# Altium schematic sheet MCU.SchDoc: Ateml SAM4S8 MCU
size A3; DrawnBy: Hassan Alhujhoj, Abdullah Naeem; Address1: ECE Department; Address2: University of Canterbury; Address3: Christchurch 8041; Address4: New Zealand; Revision: 1; SheetNumber: 1; SheetTotal: 2
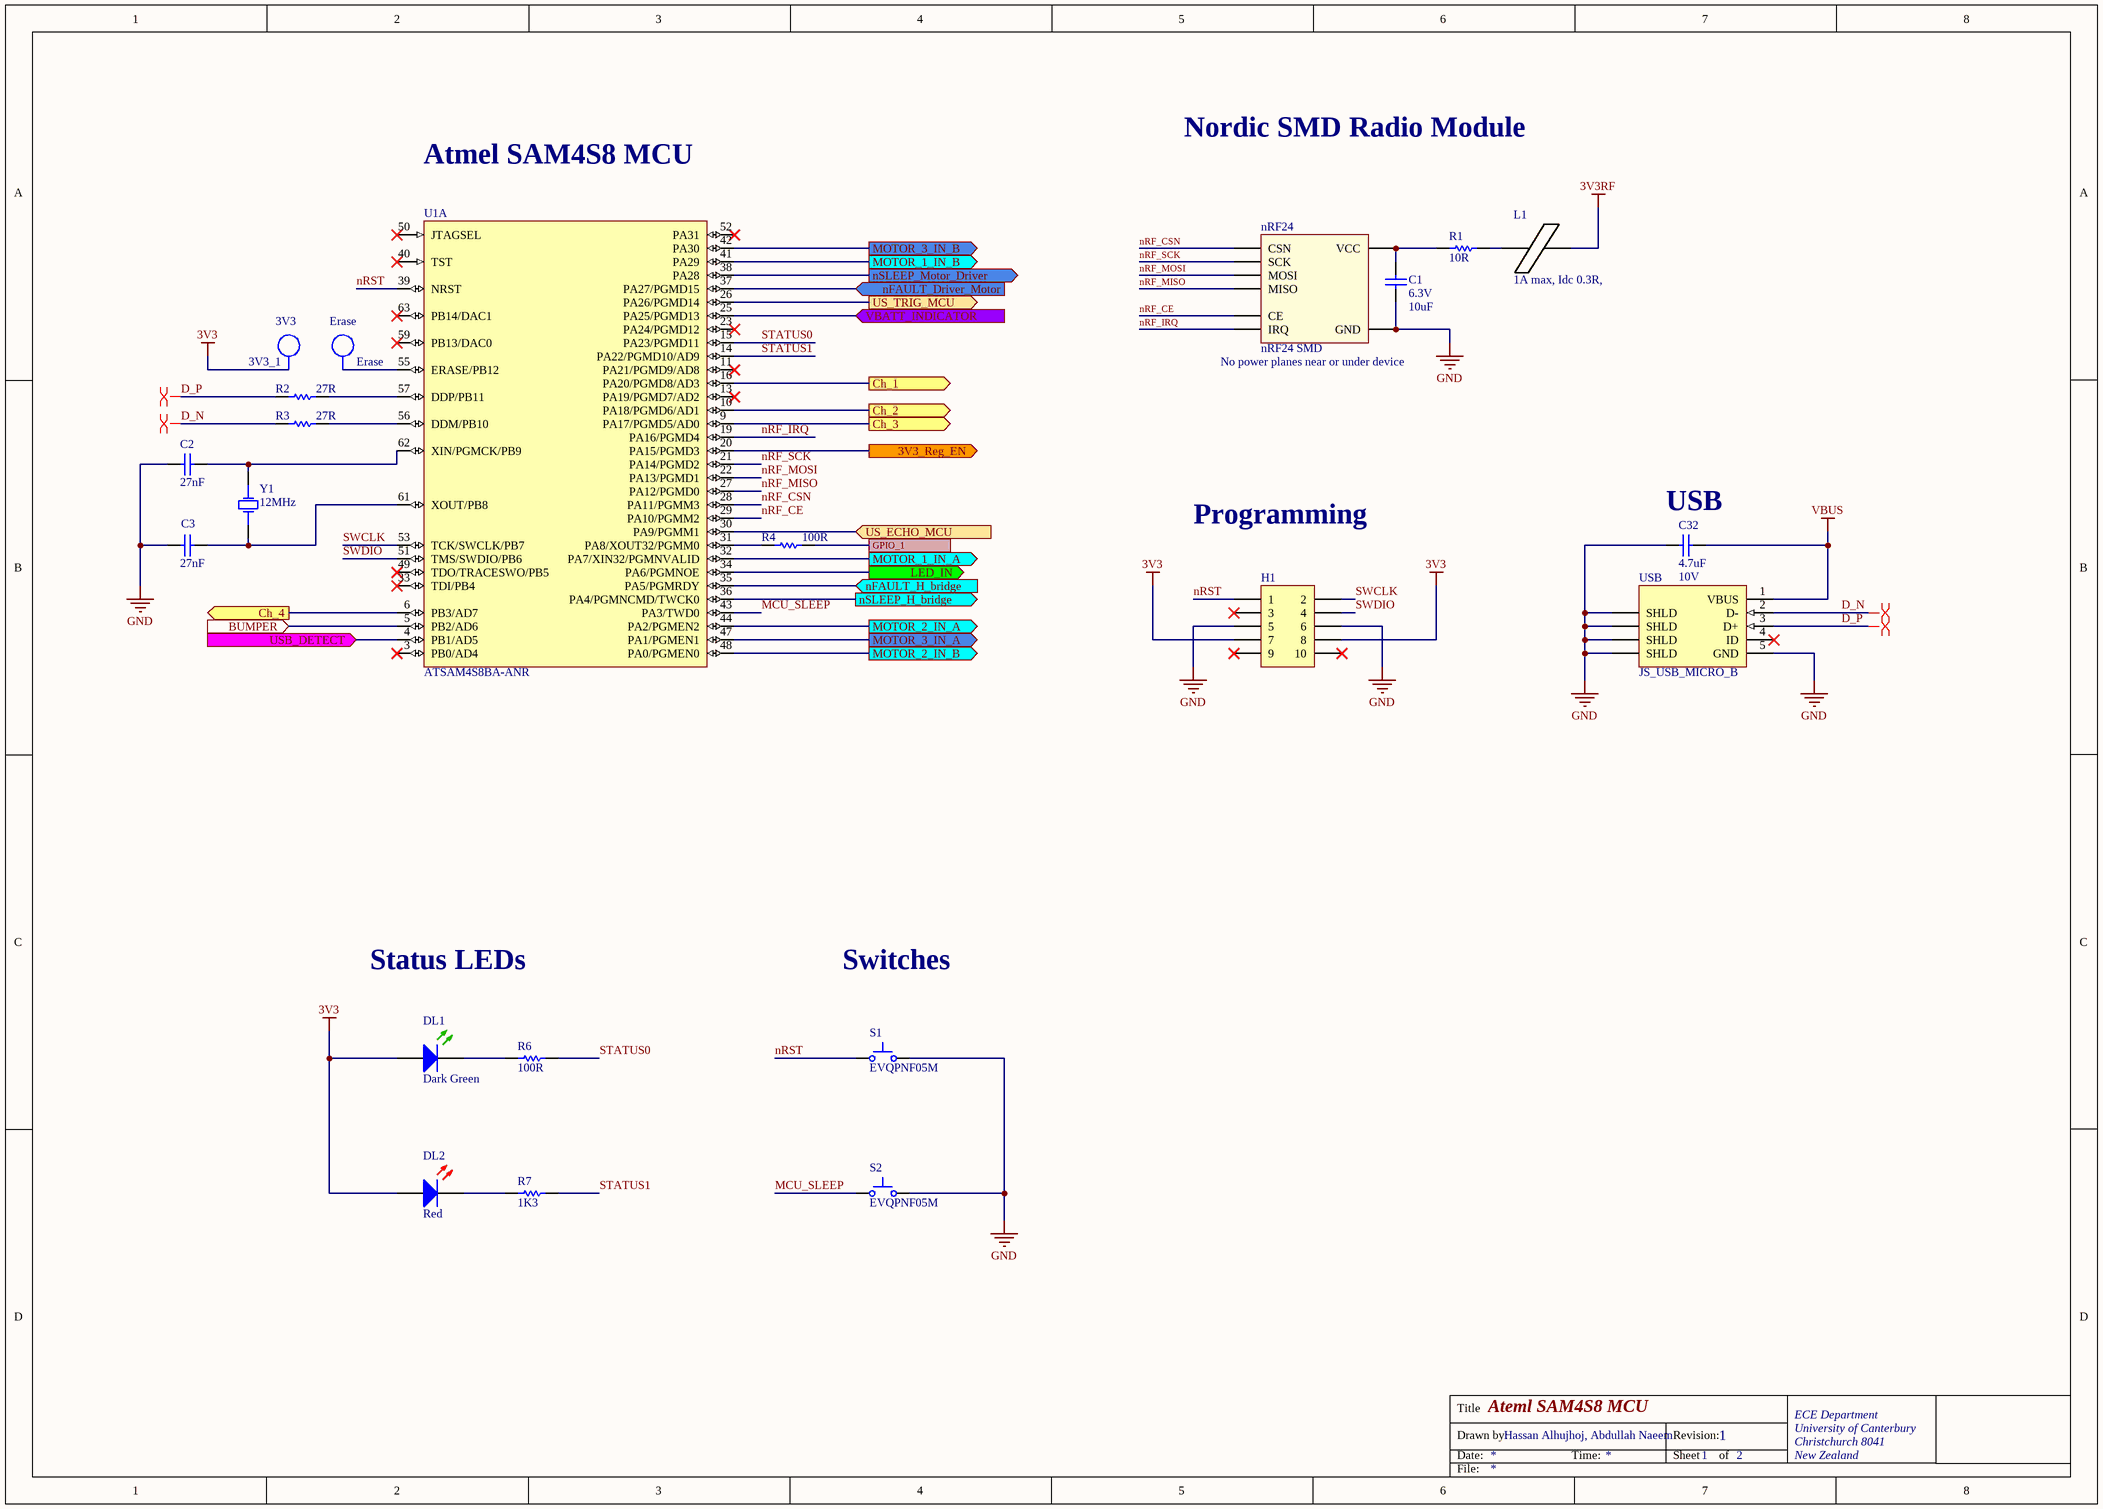
[diagram p0: MCU.SchDoc]

## Parts
3V3_1  TP  [TP_1206]  (value not drawn)  (no BOM)
C1  Voltage - Rated: 6.3V  [CAPC1608L]  (hidden comment: 10uF)
C2  27nF  [CAPC1608L]
C3  27nF  [CAPC1608L]
C32  Max Voltage: 10V  [CAPC1608N]  (hidden comment: 4.7uF)
DL1  Dark Green  [WL-SMCW0603]
DL2  Red  [WL-SMCW0603]
Erase  TP  [TP_1206]  (value not drawn)  (no BOM)
H1  Header 5X2 Vert  [IDC2.54-V10D]  (value not drawn)
L1  1A max, Idc 0.3R,  [INDC3216L]
nRF24  nRF24 SMD  Warning: No power planes near or under device  [NRF24]
R1  10R  [RESC1608L]
R2  27R  [RESC1608L]
R3  27R  [RESC1608L]
R4  100R  [RESC1608L]
R6  100R  [RESC1608L]
R7  1K3  [RESC1608L]
S1  EVQPNF05M  [EVQPNF05M]
S2  EVQPNF05M  [EVQPNF05M]
U1  ATSAM4S8BA-ANR  [LQFP64_L]  (part A of 2)
USB  JS_USB_MICRO_B  [FCI_USB_10118194-0001LF]
Y1  12MHz  [6.0X3.5-4]

## Ports
3V3_Reg_EN (out), BUMPER (in), Ch_1 (out), Ch_2 (out), Ch_3 (out), Ch_4 (out), GPIO_1, LED_IN (out), MOTOR_1_IN_A (out), MOTOR_1_IN_B (out), MOTOR_2_IN_A (out), MOTOR_2_IN_B (out), MOTOR_3_IN_A (out), MOTOR_3_IN_B (out), nFAULT_Driver_Motor (in), nFAULT_H_bridge (in), nSLEEP_H_bridge (out), nSLEEP_Motor_Driver (out), US_ECHO_MCU (in), US_TRIG_MCU (out), USB_DETECT (in), VBATT_INDICATOR (in)

## Nets
3V3: 3V3_1.1 DL1.2(A) DL2.2(A) H1.7 H1.8
3V3RF: L1.2
GND: C1.1 C2.1 C3.1 C32.1 H1.5 H1.6 nRF24.2(GND) S1.2 S2.2 USB.5(GND) USB.6(SHLD)
VBUS: C32.2 USB.1(VBUS)
3V3_Reg_EN: U1.20(PA15/PGMD3) ; port 3V3_Reg_EN
BUMPER: U1.5(PB2/AD6) ; port BUMPER
Ch_1: U1.16(PA20/PGMD8/AD3) ; port Ch_1
Ch_2: U1.10(PA18/PGMD6/AD1) ; port Ch_2
Ch_3: U1.9(PA17/PGMD5/AD0) ; port Ch_3
Ch_4: U1.6(PB3/AD7) ; port Ch_4
D_N: R3.1 USB.2(D-)
D_P: R2.1 USB.3(D+)
GPIO_1: R4.2 ; port GPIO_1
LED_IN: U1.34(PA6/PGMNOE) ; port LED_IN
MCU_SLEEP: S2.1 U1.43(PA3/TWD0)
MOTOR_1_IN_A: U1.32(PA7/XIN32/PGMNVALID) ; port MOTOR_1_IN_A
MOTOR_1_IN_B: U1.41(PA29) ; port MOTOR_1_IN_B
MOTOR_2_IN_A: U1.44(PA2/PGMEN2) ; port MOTOR_2_IN_A
MOTOR_2_IN_B: U1.48(PA0/PGMEN0) ; port MOTOR_2_IN_B
MOTOR_3_IN_A: U1.47(PA1/PGMEN1) ; port MOTOR_3_IN_A
MOTOR_3_IN_B: U1.42(PA30) ; port MOTOR_3_IN_B
nFAULT_Driver_Motor: U1.37(PA27/PGMD15) ; port nFAULT_Driver_Motor
nFAULT_H_bridge: U1.35(PA5/PGMRDY) ; port nFAULT_H_bridge
nRF_CE: nRF24.3(CE) U1.29(PA10/PGMM2)
nRF_CSN: nRF24.4(CSN) U1.28(PA11/PGMM3)
nRF_IRQ: nRF24.8(IRQ) U1.19(PA16/PGMD4)
nRF_MISO: nRF24.7(MISO) U1.27(PA12/PGMD0)
nRF_MOSI: nRF24.6(MOSI) U1.22(PA13/PGMD1)
nRF_SCK: nRF24.5(SCK) U1.21(PA14/PGMD2)
nRST: H1.1 S1.1 U1.39(NRST)
nSLEEP_H_bridge: U1.36(PA4/PGMNCMD/TWCK0) ; port nSLEEP_H_bridge
nSLEEP_Motor_Driver: U1.38(PA28) ; port nSLEEP_Motor_Driver
STATUS0: R6.2 U1.15(PA23/PGMD11)
STATUS1: R7.2 U1.14(PA22/PGMD10/AD9)
SWCLK: H1.2 U1.53(TCK/SWCLK/PB7)
SWDIO: H1.4 U1.51(TMS/SWDIO/PB6)
US_ECHO_MCU: U1.30(PA9/PGMM1) ; port US_ECHO_MCU
US_TRIG_MCU: U1.26(PA26/PGMD14) ; port US_TRIG_MCU
USB_DETECT: U1.4(PB1/AD5) ; port USB_DETECT
VBATT_INDICATOR: U1.25(PA25/PGMD13) ; port VBATT_INDICATOR
NetC1_2: C1.2 nRF24.1(VCC) R1.1
NetC2_2: C2.2 U1.62(XIN/PGMCK/PB9) Y1.3(OSC2)
NetC3_2: C3.2 U1.61(XOUT/PB8) Y1.1(OSC1)
NetDL1_1: DL1.1(K) R6.1
NetDL2_1: DL2.1(K) R7.1
NetErase_1: Erase.1 U1.55(ERASE/PB12)
NetL1_1: L1.1 R1.2
NetR2_2: R2.2 U1.57(DDP/PB11)
NetR3_2: R3.2 U1.56(DDM/PB10)
NetR4_1: R4.1 U1.31(PA8/XOUT32/PGMM0)

Not connected (* = marked no-connect by the designer): H1 3* 9* 10*; U1 3(PB0/AD4)* 11(PA21/PGMD9/AD8)* 13(PA19/PGMD7/AD2)* 23(PA24/PGMD12)* 33(TDI/PB4)* 40(TST)* 49(TDO/TRACESWO/PB5)* 50(JTAGSEL)* 52(PA31)* 59(PB13/DAC0)* 63(PB14/DAC1)*; USB 4(ID)*

## Layout directives
differential pair: D_N, D_P

## Notes on the sheet
- Atmel SAM4S8 MCU
- Nordic SMD Radio Module
- (near 3V3_1) 3V3
- (near Erase) Erase
- (near C32) USB
- Programming
- Status LEDs
- Switches
- Title
- Drawn by:
- Date:
- Time:
- Revision:
- Sheet
- of
- File:

## Library data of the parts
3V3_1 Erase = TP_1206: Test-Point 3.3x1.6x2.1mm SMD; Manufacturer: Harwin Inc; Manufacturer Part Number: S1751-46R; Manufacturer PN: *; Storage Location: ProtoPlace; Mounting Type: Surface Mount; Type: PC Test Point; Supplier 1: Digi-Key; Supplier Part Number 1: 952-1478-2-ND; Supplier 2: Farnell; Supplier Part Number 2: 1826282; Supplier: ECE Dept; Value: TP
C1 = CC_10uF_0603: CAP CER 10UF X5R +-20% 6V3 0603; Supplier: ECE Dept; Storage Location: PCB Assembly WS; Value: 10uF
C2 C3 = CC_27nF_0603: CAP CER 27nF X7R +-10% 50V 0603; PackageReference: 0603; Code_IPC: 1608 [0603]; Verify: *; Supplier: ECE Dept; Storage Location: PCB Assembly WS; Value: 27nF
C32 = CC_4.7uF_0603: CAP CER 4.7uF X5R +-20%  10V 0603; Note: Footprint corresponds to dimensions for bulk cassette packaging. This case size has tightened tolerances.; PackageReference: 0805; Code_IPC: 2012[0805]; Verify: *; Supplier: ECE Dept; Storage Location: PCB Assembly WS; Value: 4.7uF
DL1 = DL_150060GS75000: LED Dk Green 430mcd 0603 SMD; Manufacturer: WURTH ELEKTRONIK; Forward Current If: 30; Wavelength Typ: 520; Forward Voltage: 3.2; Lens Shape: Rectangular; Luminous Intensity: 430; Viewing Angle: 140°; LED Mounting: SMD; Supplier 1: Farnell; Supplier Part Number 1: 2322070; Manufacturer Part Number: 150060GS75000; Storage Location: PCB Assembly WS; Supplier: ECE Dept; LED Colour: Dark Green
DL2 = DL_150060RS75000: LED Red 250mcd 0603 SMD; Manufacturer: WURTH ELEKTRONIK; Forward Current If: 30; Forward Voltage: 2; Lens Shape: Rectangular; Luminous Intensity: 250; Wavelength Typ: 625; Viewing Angle: 140°; LED Mounting: SMD; Supplier 1: Farnell; Supplier Part Number 1: 2322071; Manufacturer Part Number: 150060RS75000; Storage Location: PCB Assembly WS; Supplier: ECE Dept; LED Colour: Red
H1 = JA_HDR_IDC_5X2_VERT: IDC Header, 2,54mm, 10-Pin, Vert; Supplier: ECE Dept; Supplier 1: Farnell; Supplier Part Number 1: 1096985; Storage Location: ECE Dept Store
L1 = IN_Ferrite-Bead: Ferrite Bead, Rdc 0.3R, Z100MHZ 600R, Imax 1A, SMD 1206; Manufacturer: FAIR-RITE; Manufacturer PN: 2512066017Y1; DC Current Rating: 1; DC Resistance Max: 0.08; Ferrite Case Style: 1206 ^3216 Metric]; Frequency Range: 50MHz to 1; Impedance: 600; Impedance Tolerance: ± 25%; Supplier: ECE Dept; Storage Location: PCB Assembly WS; Ferrite Mounting: SMD; Supplier 1: Farnell; Supplier Part Number 1: 1612060; Manufacturer Part Number: 2512066017Y1; Value: 1A max, Idc 0.3R,
nRF24 = NRF24: nRF24 SMD Module
R1 = RS_10R: RES 10 OHM 1/10W 5% 0603 SMD; Storage Location: PCB Assembly WS; Supplier: ECE Dept; Value: 10R
R2 R3 = RS_27R: RES 27 OHM 1/10W 5% 0603 SMD; Storage Location: PCB Assembly WS; Supplier: ECE Dept; Value: 27R
R4 R6 = RS_100R: RES 100 OHM 1/10W 5% 0603 SMD; Storage Location: PCB Assembly WS; Supplier: ECE Dept; Value: 100R
R7 = RS_1K3: RES 1.3K OHM 1/10W 5% 0603 SMD; Storage Location: PCB Assembly WS; Supplier: ECE Dept; Value: 1K3
S1 S2 = WS_EVQPNF05M: Panasonic 6 x 3.5mm SMD Light Touch Switch Type SMD; PackageDescription: 6.0 x 3.5 mm; Supplier 1: Farnell; Supplier Part Number 1: 2079481; Manufacturer: Panasonic; Manufacturer PN: EVQPNF05M; Supplier 2: Digi-Key; Supplier Part Number 2: P13598SCT-ND; Storage Location: PCB Assembly WS; Supplier: ECE Dept
U1 = SE_ATSAM4S16BA-MU: IC MCU 32BIT 512KB FLASH 64LQFP; Manufacturer: Atmel; Connectivity: I²C, IrDA, Memory Card, SPI, SSC, UART/USART, USB; Core Processor: ARM® Cortex®-M4; Core Size: 32-Bit; Data Converters: A/D 11x12b, D/A 2x12b; Number of I/O: 47; Peripherals: Brown-out Detect/Reset, DMA, POR, PWM, WDT; Program Memory Size: 512KB (512K x 8); RAM Size: 128K x 8; Speed: 120MHz; Voltage - Supply (Vcc/Vdd): 1.62 V ~ 3.6 V; PackageVersion: revJ, Jul-2007; PackageReference: 64PS; PackageDescription: 64-Pin Quad Flat No-Lead (QFN) Sawn, 9 x 9 x 1.0 mm Body, 0.5 mm Pitch, Exposed Pad; Code_JEDEC: MO-220VMMD-3; ComponentLink1Description: Manufacturer URL; ComponentLink1URL: http://www.atmel.com/; ComponentLink2Description: SAM4S Series Datasheet; ComponentLink2URL: http://www.atmel.com/dyn/resources/prod_documents/11100.pdf; ComponentLink3Description: SAM4S Series Summary; ComponentLink3URL: http://www.atmel.com/dyn/resources/prod_documents/11100S.pdf; Supplier 1: Digi-Key; Package / Case: 64-LQFP; Packaging: Cut Tape (CT); Program Memory Type: FLASH; Supplier Part Number 1: ATSAM4S8BA-ANRCT-ND; Manufacturer Part Number: ATSAM4S8BA-ANR
USB = JS_USB_MICRO_B_SMT: CONN USB MICRO B RECPT SMT R/A; Manufacturer: FCI; Manufacturer Part Number: 10118194-0001LF; Gender: Receptacle; Number of Contacts: 5; Specifications: USB 2.0; Supplier 1: Digi-Key; Supplier Part Number 1: 609-4618-1-ND; Features: Shielded, Solder Retention; Mounting Type: Surface Mount, Right Angle, Horizontal
Y1 = XT_CRYSTAL_12MHz_18pF: CRYSTAL 12MHZ 18PF 6X3.5mm SMD; Manufacturer: CTS-Frequency Controls; Manufacturer Part Number: 406C35D12M00000; ESR (Equivalent Series Resistance): 60 Ohm; Frequency Stability: ±50ppm; Frequency Tolerance: ±30ppm; Operating Mode: Fundamental; Supplier 1: Digi-Key; Height: 0.047" (1.20mm); Load Capacitance: 18pF; Mounting Type: Surface Mount; Operating Temperature: -20°C ~ 70°C; Package / Case: 4-SMD, No Lead (DFN, LCC); Size / Dimension: 0.236" L x 0.138" W (6.00mm x 3.50mm); Supplier Part Number 1: CTX855CT-ND; Frequency: 12MHz